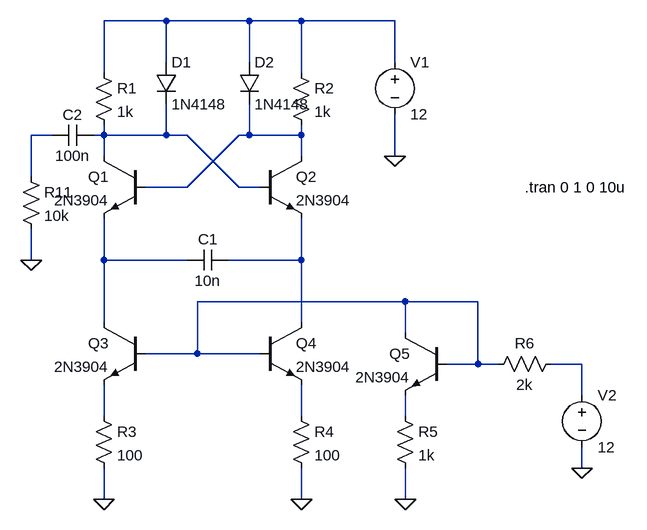
[diagram p0: schematic ECVCO.asc]
ECVCO.asc, the LTspice schematic file:
Version 4
SHEET 1 1328 680
WIRE 224 -256 128 -256
WIRE 352 -256 224 -256
WIRE 432 -256 352 -256
WIRE 576 -256 432 -256
WIRE 224 -192 224 -256
WIRE 352 -192 352 -256
WIRE 576 -192 576 -256
WIRE 128 -176 128 -256
WIRE 432 -176 432 -256
WIRE 48 -80 16 -80
WIRE 128 -80 128 -96
WIRE 128 -80 112 -80
WIRE 224 -80 224 -128
WIRE 224 -80 128 -80
WIRE 256 -80 224 -80
WIRE 352 -80 352 -128
WIRE 352 -80 336 -80
WIRE 432 -80 432 -96
WIRE 432 -80 352 -80
WIRE 128 -48 128 -80
WIRE 432 -48 432 -80
WIRE 576 -48 576 -112
WIRE 16 -16 16 -80
WIRE 256 0 336 -80
WIRE 256 0 192 0
WIRE 336 0 256 -80
WIRE 368 0 336 0
WIRE 16 112 16 64
WIRE 128 112 128 48
WIRE 256 112 128 112
WIRE 432 112 432 48
WIRE 432 112 320 112
WIRE 592 176 272 176
WIRE 704 176 592 176
WIRE 128 208 128 112
WIRE 432 208 432 112
WIRE 592 224 592 176
WIRE 272 256 272 176
WIRE 272 256 192 256
WIRE 368 256 272 256
WIRE 704 272 704 176
WIRE 704 272 656 272
WIRE 736 272 704 272
WIRE 864 272 816 272
WIRE 864 320 864 272
WIRE 128 352 128 304
WIRE 432 352 432 304
WIRE 592 352 592 320
WIRE 864 432 864 400
WIRE 128 480 128 432
WIRE 432 480 432 432
WIRE 592 480 592 432
FLAG 576 -48 0
FLAG 128 480 0
FLAG 432 480 0
FLAG 592 480 0
FLAG 864 432 0
FLAG 16 112 0
SYMBOL npn 192 -48 M0
SYMATTR InstName Q1
SYMATTR Value 2N3904
SYMBOL npn 368 -48 R0
SYMATTR InstName Q2
SYMATTR Value 2N3904
SYMBOL npn 192 208 M0
SYMATTR InstName Q3
SYMATTR Value 2N3904
SYMBOL npn 368 208 R0
SYMATTR InstName Q4
SYMATTR Value 2N3904
SYMBOL cap 320 96 R90
WINDOW 0 0 32 VBottom 2
WINDOW 3 32 32 VTop 2
SYMATTR InstName C1
SYMATTR Value 10n
SYMBOL res 112 -192 R0
SYMATTR InstName R1
SYMATTR Value 1k
SYMBOL res 416 -192 R0
SYMATTR InstName R2
SYMATTR Value 1k
SYMBOL voltage 576 -208 R0
WINDOW 123 0 0 Left 2
WINDOW 39 0 0 Left 2
SYMATTR InstName V1
SYMATTR Value 12
SYMBOL res 112 336 R0
SYMATTR InstName R3
SYMATTR Value 100
SYMBOL res 416 336 R0
SYMATTR InstName R4
SYMATTR Value 100
SYMBOL npn 656 224 M0
SYMATTR InstName Q5
SYMATTR Value 2N3904
SYMBOL res 576 336 R0
SYMATTR InstName R5
SYMATTR Value 1k
SYMBOL res 832 256 R90
WINDOW 0 0 56 VBottom 2
WINDOW 3 32 56 VTop 2
SYMATTR InstName R6
SYMATTR Value 2k
SYMBOL voltage 864 304 R0
WINDOW 123 0 0 Left 2
WINDOW 39 0 0 Left 2
SYMATTR InstName V2
SYMATTR Value 12
SYMBOL diode 208 -192 R0
SYMATTR InstName D1
SYMATTR Value 1N4148
SYMBOL diode 336 -192 R0
SYMATTR InstName D2
SYMATTR Value 1N4148
SYMBOL res 0 -32 R0
SYMATTR InstName R11
SYMATTR Value 10k
SYMBOL cap 112 -96 R90
WINDOW 0 0 32 VBottom 2
WINDOW 3 32 32 VTop 2
SYMATTR InstName C2
SYMATTR Value 100n
TEXT 776 0 Left 2 !.tran 0 1 0 10u

The netlist it stands for:
* ECVCO.asc
Q1 N003 N004 N005 0 2N3904
Q2 N004 N003 N006 0 2N3904
Q3 N005 N007 N009 0 2N3904
Q4 N006 N007 N010 0 2N3904
C1 N006 N005 10n
R1 N001 N003 1k
R2 N001 N004 1k
V1 N001 0 12
R3 N009 0 100
R4 N010 0 100
Q5 N007 N007 N011 0 2N3904
R5 N011 0 1k
R6 N008 N007 2k
V2 N008 0 12
D1 N001 N003 1N4148
D2 N001 N004 1N4148
R11 N002 0 10k
C2 N003 N002 100n
.model D D
.lib standard.dio
.model NPN NPN
.model PNP PNP
.lib standard.bjt
.tran 0 1 0 10u
.backanno
.end